# EAGLE design Main (EAGLE 4.16)
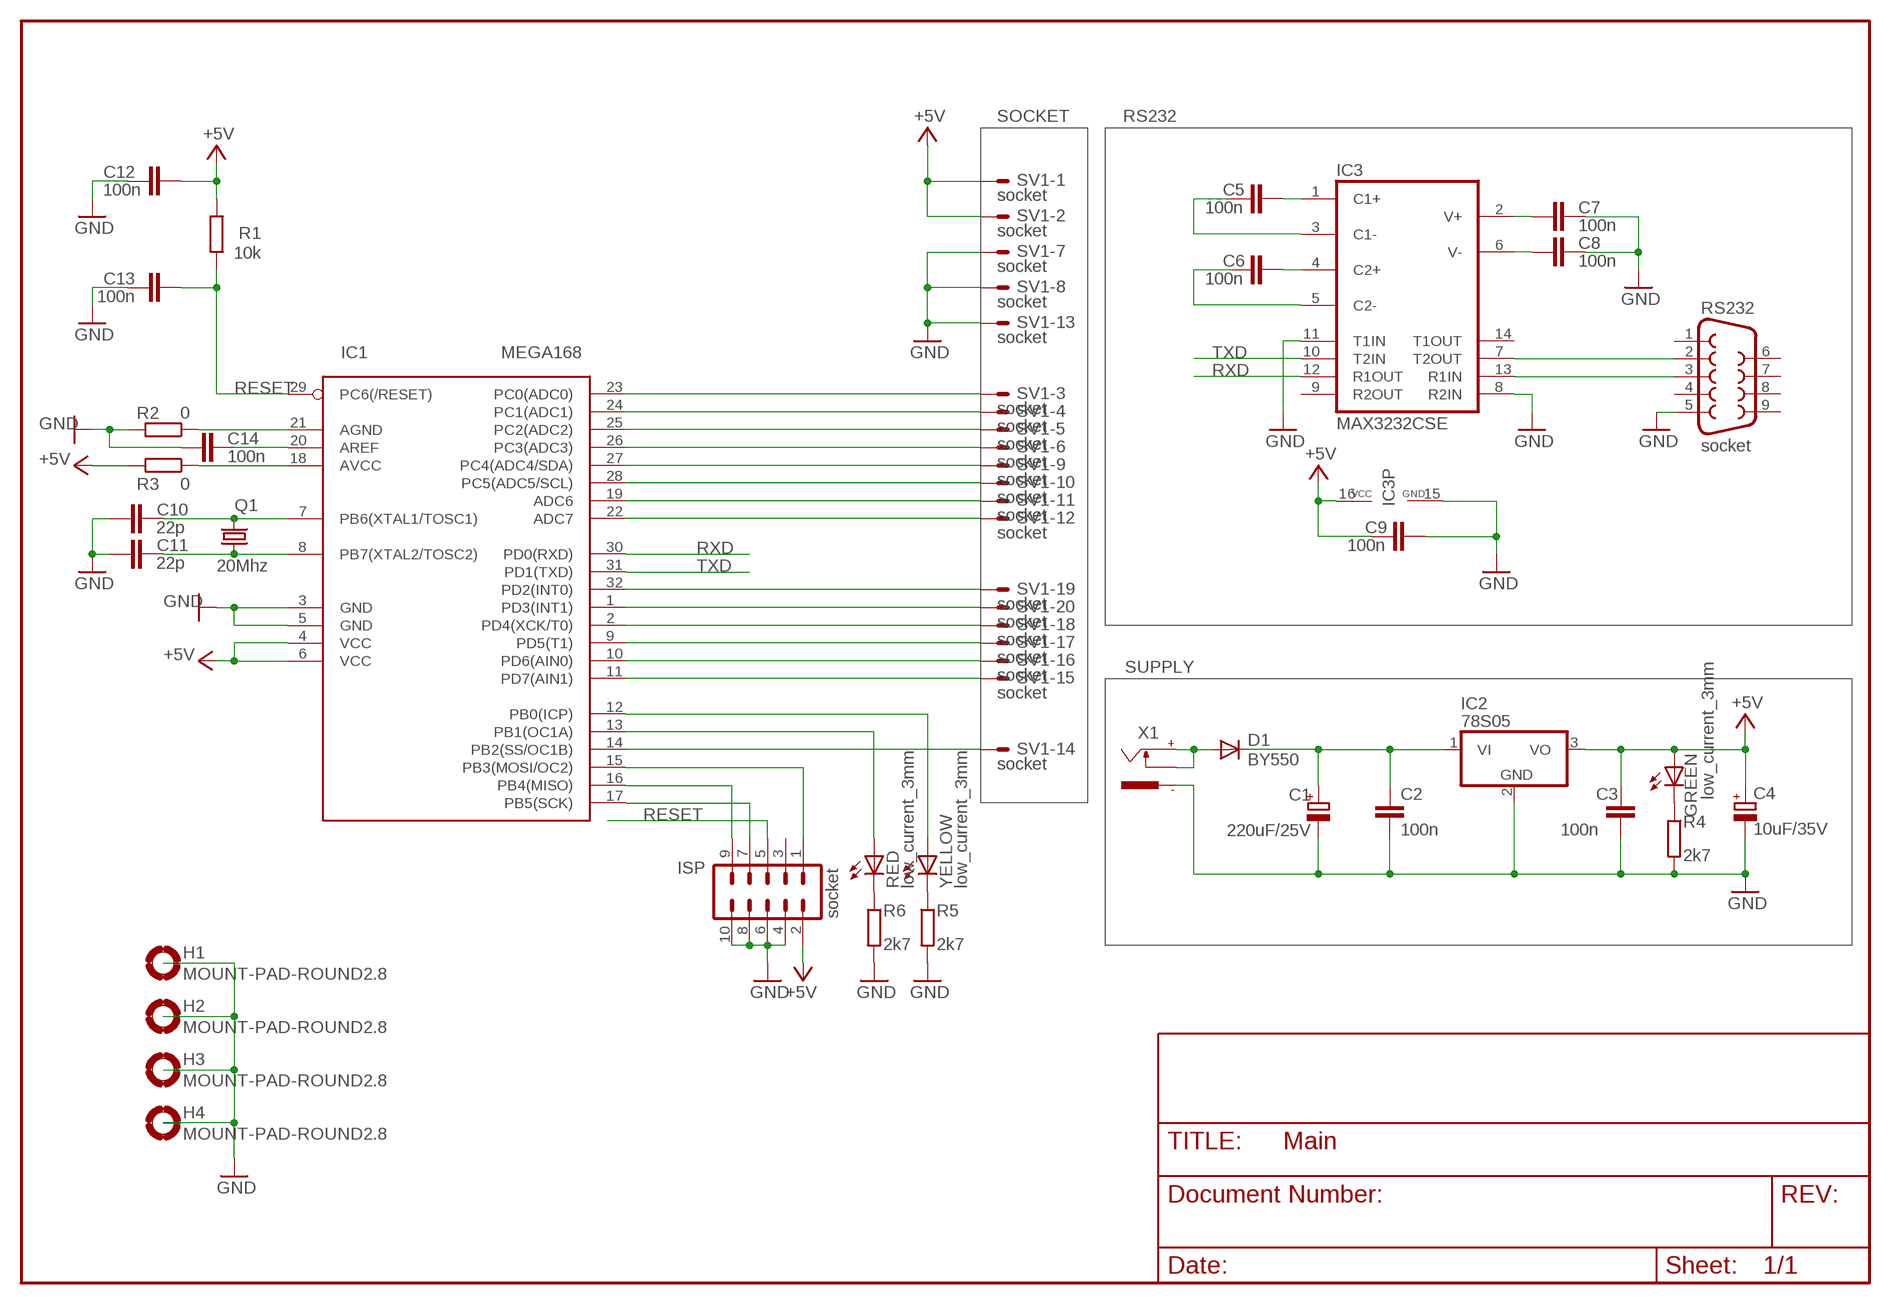
[diagram p0: schematic, sheet 1]

## Parts
C1  220uF/25V  CPOL-EUE3.5-8  [E3,5-8]
C2  100n  C-EUC0603K  [C0603K]
C3  100n  C-EUC0603K  [C0603K]
C4  10uF/35V  CPOL-EUE2-5  [E2-5]
C5  100n  C-EUC0603K  [C0603K]
C6  100n  C-EUC0603K  [C0603K]
C7  100n  C-EUC0603K  [C0603K]
C8  100n  C-EUC0603K  [C0603K]
C9  100n  C-EUC0603K  [C0603K]
C10  22p  C-EUC0603K  [C0603K]
C11  22p  C-EUC0603K  [C0603K]
C12  100n  C-EUC0603K  [C0603K]
C13  100n  C-EUC0603K  [C0603K]
C14  100n  C-EUC0603K  [C0603K]
D1  BY550  [DO27-15]
GREEN  low_current_3mm  LED3MM  [LED3MM]
H1  MOUNT-PAD-ROUND2.8  [2,8-PAD]
H2  MOUNT-PAD-ROUND2.8  [2,8-PAD]
H3  MOUNT-PAD-ROUND2.8  [2,8-PAD]
H4  MOUNT-PAD-ROUND2.8  [2,8-PAD]
IC1  MEGA168  MEGA8-AI  [TQFP32-08]
IC2  78S05  7805T  [TO220H]
IC3  MAX3232CSE  [SO16]
ISP  socket  MA05-2  [MA05-2]
Q1  20Mhz  CRYTALHC49U-V  [HC49U-V]
R1  10k  R-EU_R0805  [R0805]
R2  0  R-EU_R0805  [R0805]
R3  0  R-EU_R0805  [R0805]
R4  2k7  R-EU_R0805  [R0805]
R5  2k7  R-EU_R0805  [R0805]
R6  2k7  R-EU_R0805  [R0805]
RED  low_current_3mm  LED3MM  [LED3MM]
RS232  socket  F09HP  [F09HP]
SV1  socket  ML20E  [ML20]
X1  737992-55  [737992-5]
YELLOW  low_current_3mm  LED3MM  [LED3MM]

## Nets
+5V: C3.1 C4.+ C9.1 C12.2 GREEN.A IC1.4(VCC) IC1.6(VCC) IC2.3(VO) IC3.16(VCC) ISP.2 R1.2 R3.2 SV1.1 SV1.2
GND: C1.- C2.2 C3.2 C4.- C7.2 C8.2 C9.2 C10.1 C11.1 C12.1 C13.1 C14.1 H1.B2,8(MOUNT) H2.B2,8(MOUNT) H3.B2,8(MOUNT) H4.B2,8(MOUNT) IC1.3(GND) IC1.5(GND) IC2.2(GND) IC3.8(R2IN) IC3.11(T1IN) IC3.15(GND) ISP.4 ISP.6 ISP.8 ISP.10 R2.2 R4.2 R5.2 R6.2 RS232.5 SV1.7 SV1.8 SV1.13 X1.-1
MISO: IC1.16(PB4(MISO)) ISP.9
MOSI: IC1.15(PB3(MOSI/OC2)) ISP.1
N$1: C1.+ C2.1 D1.C IC2.1(VI)
N$2: IC3.13(R1IN) RS232.3
N$3: IC3.7(T2OUT) RS232.2
N$4: C5.2 IC3.1(C1+)
N$5: C6.2 IC3.4(C2+)
N$6: C5.1 IC3.3(C1-)
N$7: C6.1 IC3.5(C2-)
N$8: C7.1 IC3.2(V+)
N$9: C8.1 IC3.6(V-)
N$10: C10.2 IC1.7(PB6(XTAL1/TOSC1)) Q1.2
N$11: C11.2 IC1.8(PB7(XTAL2/TOSC2)) Q1.1
N$12: D1.A X1.+ X1.K
N$13: C14.2 IC1.20(AREF)
N$14: IC1.18(AVCC) R3.1
N$15: IC1.21(AGND) R2.1
N$16: IC1.23(PC0(ADC0)) SV1.3
N$17: IC1.24(PC1(ADC1)) SV1.4
N$18: IC1.25(PC2(ADC2)) SV1.5
N$19: IC1.26(PC3(ADC3)) SV1.6
N$20: IC1.27(PC4(ADC4/SDA)) SV1.9
N$21: IC1.28(PC5(ADC5/SCL)) SV1.10
N$22: IC1.19(ADC6) SV1.11
N$23: IC1.22(ADC7) SV1.12
N$24: IC1.10(PD6(AIN0)) SV1.16
N$25: IC1.11(PD7(AIN1)) SV1.15
N$26: IC1.9(PD5(T1)) SV1.17
N$27: IC1.2(PD4(XCK/T0)) SV1.18
N$28: IC1.1(PD3(INT1)) SV1.20
N$29: IC1.32(PD2(INT0)) SV1.19
N$30: IC1.14(PB2(SS/OC1B)) SV1.14
N$31: GREEN.K(C) R4.1
N$32: IC1.12(PB0(ICP)) YELLOW.A
N$33: R5.1 YELLOW.K(C)
N$34: R6.1 RED.K(C)
N$35: IC1.13(PB1(OC1A)) RED.A
RESET: C13.2 IC1.29(PC6(/RESET)) ISP.5 R1.1
RXD: IC1.30(PD0(RXD)) IC3.12(R1OUT)
SCK: IC1.17(PB5(SCK)) ISP.7
TXD: IC1.31(PD1(TXD)) IC3.10(T2IN)
Unconnected: IC3.9(R2OUT) IC3.14(T1OUT) ISP.3 RS232.1 RS232.4 RS232.6 RS232.7 RS232.8 RS232.9 X1.-2

## Notes on the sheet
- SOCKET | RS232
- SUPPLY

## Library data of the parts
C1 C4 = rcl:CPOL-EU: POLARIZED CAPACITOR, European symbol
C2 C3 C5-C14 = rcl:C-EU: CAPACITOR, European symbol
D1 = diode:BY550: DIODE Si200 V, 5 A
GREEN RED YELLOW = led:LED: LED OSRAM: - CHIPLED LG R971, LG N971, LY N971, LG Q971, LY Q971, LO R971, LY R971 LH N974, LH R974 LS Q976, LO Q976, LY Q976 LO Q996 - Hyper CHIPLED LW Q18S LB Q993, LB Q99A, LB R99A - SideLED LS A670, LO A670, LY A670, LG A670, LP A670 LB A673, LV A673, LT A673, LW A673 LH A674 LY A675 LS A676, LA A676, LO A676, LY A676, LW A676 LS A679, LY A679, LG A679 - Hyper Micro SIDELED® LS Y876, LA Y876, LO Y876, LY Y876 LT Y87S - SmartLED LW L88C, LW L88S LB L89C, LB L89S, LG L890 LS L89K, LO L89K, LY L89K LS L896, LA L896, LO L896, LY L896 - TOPLED LS T670, LO T670, LY T670, LG T670, LP T670 LSG T670, LSP T670, LSY T670, LOP T670, LYG T670 LG T671, LOG T671, LSG T671 LB T673, LV T673, LT T673, LW T673 LH T674 LS T676, LA T676, LO T676, LY T676, LB T676, LH T676, LSB T676, LW T676 LB T67C, LV T67C, LT T67C, LS T67K, LO T67K, LY T67K, LW E67C LS E67B, LA E67B, LO E67B, LY E67B, LB E67C, LV E67C, LT E67C LW T67C LS T679, LY T679, LG T679 LS T770, LO T770, LY T770, LG T770, LP T770 LB T773, LV T773, LT T773, LW T773 LH T774 LS E675, LA E675, LY E675, LS T675 LS T776, LA T776, LO T776, LY T776, LB T776 LHGB T686 LT T68C, LB T68C - Hyper Mini TOPLED® LB M676 - Mini TOPLED Santana® LG M470 LS M47K, LO M47K, LY M47K Source: http://www.osram.convergy.de - LUMILED® LXK2-PW12-R00, LXK2-PW12-S00, LXK2-PW14-U00, LXK2-PW14-V00 LXK2-PM12-R00, LXK2-PM12-S00, LXK2-PM14-U00 LXK2-PE12-Q00, LXK2-PE12-R00, LXK2-PE12-S00, LXK2-PE14-T00, LXK2-PE14-U00 LXK2-PB12-K00, LXK2-PB12-L00, LXK2-PB12-M00, LXK2-PB14-N00, LXK2-PB14-P00, LXK2-PB14-Q00 LXK2-PR12-L00, LXK2-PR12-M00, LXK2-PR14-Q00, LXK2-PR14-R00 LXK2-PD12-Q00, LXK2-PD12-R00, LXK2-PD12-S00 LXK2-PH12-R00, LXK2-PH12-S00 LXK2-PL12-P00, LXK2-PL12-Q00, LXK2-PL12-R00 Source: www.luxeon.com
H1-H4 = holes:MOUNT-PAD-ROUND: MOUNTING PAD, round
IC1 = atmel:MEGA8: MICROCONTROLLER 8 Kbytes FLASH 1 kbytes SRAM 512 bytes EEPROM USART 6-channel 10 bit ADC 2-channel 8 bit ADC Source: avr.lbr
IC2 = linear:78*: Positive VOLTAGE REGULATOR Source: http://cache.national.com/ds/LM/LM78L05.pdf http://www.fairchildsemi.com/ds/LM/LM7805.pdf
IC3 = maxim:MAX3232*: True RS-232 Transceivers 3.0V to 5.5V, Low-Power up to 1Mbps, Using Four 0.1µF External Capacitors Source: http://pdfserv.maxim-ic.com/en/ds/MAX3222-MAX3241.pdf
ISP = con-lstb:MA05-2: PIN HEADER
Q1 = crystal:CRYTAL: CRYSTAL
R1-R6 = rcl:R-EU_: RESISTOR, European symbol
RS232 = con-subd:F09: SUB-D
SV1 = con-harting-ml:ML20?E: HARTING
X1 = con-conrad:737992-55: FEMALE PRINT CONNECTOR DIN 45323 (34V/3A), ROKA, distributor Conrad

## Board
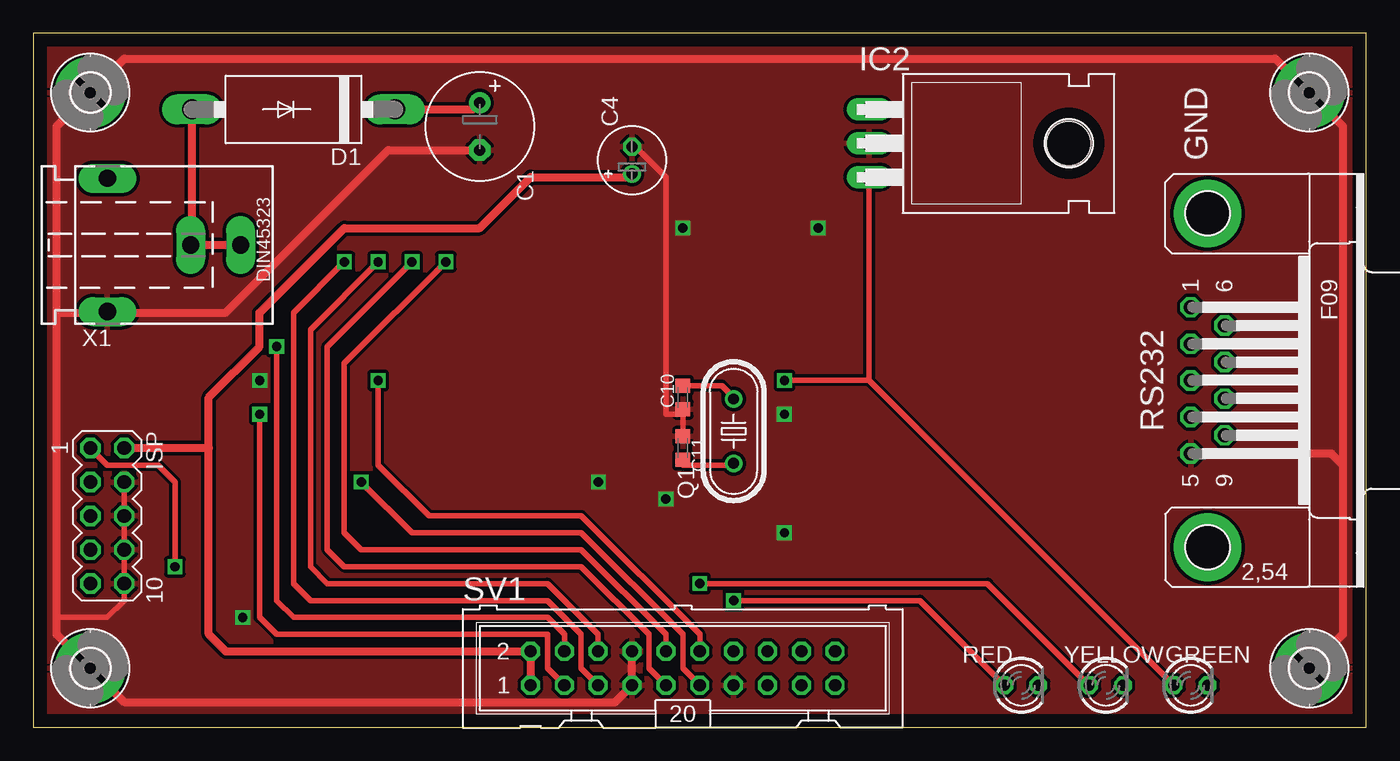
[diagram p1: board, top side]
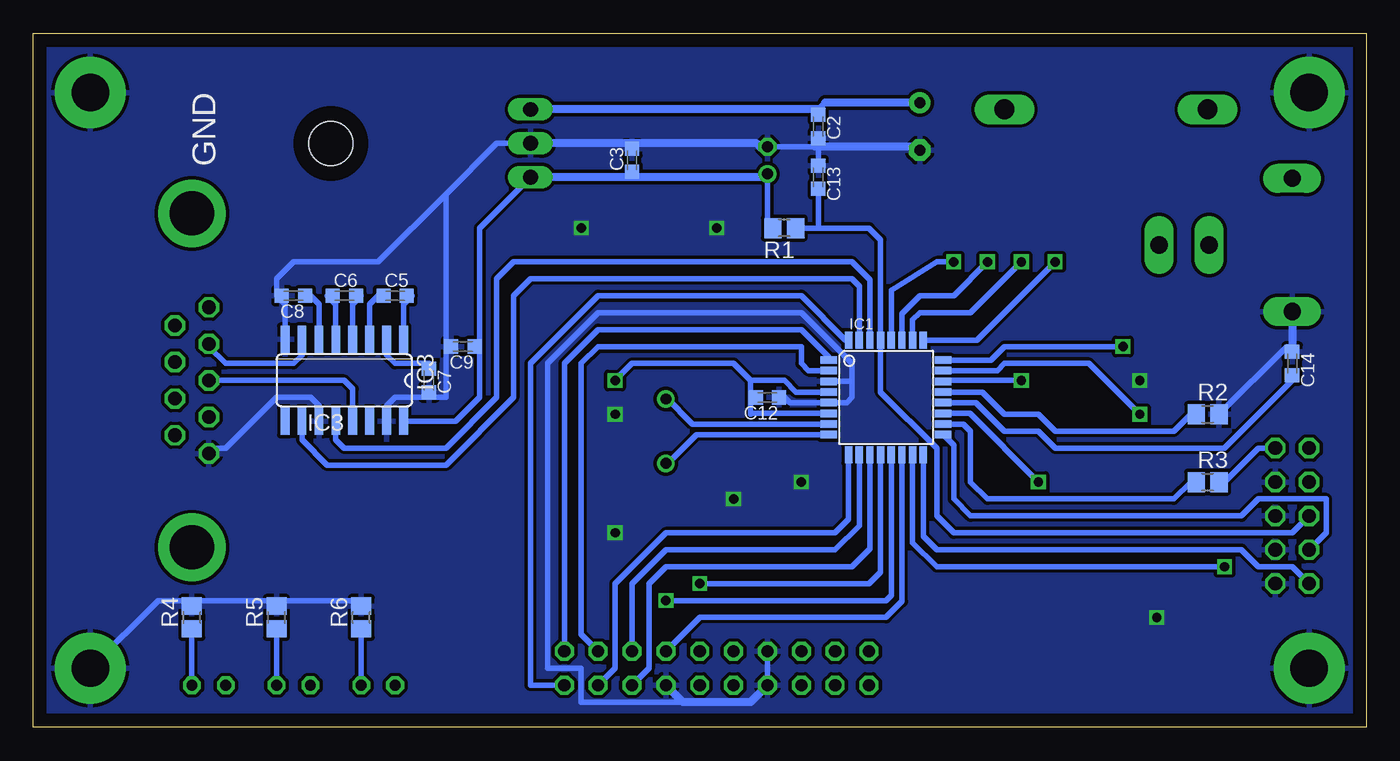
[diagram p2: board, bottom side, seen from below]

Size 100 x 52.05 mm. Coordinates in mm from the lower left corner, seen from the top.
Outline: 0,52.05 0,0 100,0 100,52.05 0,52.05
Copper layers (1*16): Top 0.035mm / dielectric 1.5mm / Bottom 0.035mm
Design rules "olimex_8mils": minimum track width 10mil, minimum drill 24mil, track to track 8mil, track to pad 8mil, pad to pad 8mil, via to via 8mil, smd to smd 8mil, copper to edge 40mil, drill to drill 10mil, minimum pad ring 10mil, minimum via ring 8mil, stop-mask expansion 0mil, vias tented up to drill 0mil, thermal gap 10mil

### Footprints (pad centres in the part's own frame; a part is rotated, then mirrored left to right if it is on the bottom)
E3,5-8 = drill 0.813 pad 1.6 round: + -1.778,0 | drill 0.813 pad 1.6 octagon: - 1.778,0
C0603K = smd 1.05 x 1.08: 1 -0.875,0; 2 0.875,0
E2-5 = drill 0.813 pad 1.27 round: + -1.016,0 | drill 0.813 pad 1.27 octagon: - 1.016,0
DO27-15 = drill 1.499 long: A 7.62,0; C -7.62,0
LED3MM = drill 0.813 octagon: A -1.27,0; K 1.27,0
2,8-PAD = drill 2.8 pad 5.334 round: B2,8 0,0
TQFP32-08 = smd 1.27 x 0.559: 1 -4.293,2.8; 2 -4.293,2; 3 -4.293,1.2; 4 -4.293,0.4; 5 -4.293,-0.4; 6 -4.293,-1.2; 7 -4.293,-2; 8 -4.293,-2.8; 17 4.293,-2.8; 18 4.293,-2; 19 4.293,-1.2; 20 4.293,-0.4; 21 4.293,0.4; 22 4.293,1.2; 23 4.293,2; 24 4.293,2.8 | smd 0.559 x 1.27: 9 -2.8,-4.293; 10 -2,-4.293; 11 -1.2,-4.293; 12 -0.4,-4.293; 13 0.4,-4.293; 14 1.2,-4.293; 15 2,-4.293; 16 2.8,-4.293; 25 2.8,4.293; 26 2,4.293; 27 1.2,4.293; 28 0.4,4.293; 29 -0.4,4.293; 30 -1.2,4.293; 31 -2,4.293; 32 -2.8,4.293
TO220H = drill 1.118 long: 1 -2.54,-10.16; 2 0,-10.16; 3 2.54,-10.16 | hole 3.302: 0,4.826
SO16 = smd 0.66 x 2.032: 1 -4.445,-3.073; 2 -3.175,-3.073; 3 -1.905,-3.073; 4 -0.635,-3.073; 5 0.635,-3.073; 6 1.905,-3.073; 7 3.175,-3.073; 8 4.445,-3.073; 9 4.445,3.073; 10 3.175,3.073; 11 1.905,3.073; 12 0.635,3.073; 13 -0.635,3.073; 14 -1.905,3.073; 15 -3.175,3.073; 16 -4.445,3.073
MA05-2 = drill 1.016 octagon: 1 -5.08,-1.27; 2 -5.08,1.27; 3 -2.54,-1.27; 4 -2.54,1.27; 5 0,-1.27; 6 0,1.27; 7 2.54,-1.27; 8 2.54,1.27; 9 5.08,-1.27; 10 5.08,1.27
HC49U-V = drill 0.813 round: 1 -2.413,0; 2 2.413,0
R0805 = smd 1.3 x 1.5: 1 -0.85,0; 2 0.85,0
F09HP = drill 1.016 octagon: 1 -5.486,-1.27; 2 -2.743,-1.27; 3 0,-1.27; 4 2.743,-1.27; 5 5.486,-1.27; 6 -4.115,1.27; 7 -1.372,1.27; 8 1.372,1.27; 9 4.115,1.27 | drill 3.302 pad 5.08 round: G1 -12.522,0; G2 12.522,0
ML20 = drill 0.914 octagon: 1 -11.43,-1.27; 2 -11.43,1.27; 3 -8.89,-1.27; 4 -8.89,1.27; 5 -6.35,-1.27; 6 -6.35,1.27; 7 -3.81,-1.27; 8 -3.81,1.27; 9 -1.27,-1.27; 10 -1.27,1.27; 11 1.27,-1.27; 12 1.27,1.27; 13 3.81,-1.27; 14 3.81,1.27; 15 6.35,-1.27; 16 6.35,1.27; 17 8.89,-1.27; 18 8.89,1.27; 19 11.43,-1.27; 20 11.43,1.27
737992-5 = drill 1.3 pad 2.184 long: + 0,10; -1 5,0; -2 -5,0; K 0,6.25

### Placement (x,y rotation side)
C1  33.49,45.07 270 top
C2  41.11,45.07 270 bottom
C3  55.08,42.53 90 bottom
C4  44.92,42.53 90 top
C5  72.86,32.37 0 bottom
C6  76.67,32.37 0 bottom
C7  70.32,26.02 270 bottom
C8  80.48,32.37 180 bottom
C9  67.78,28.56 180 bottom
C10  48.73,24.75 90 top
C11  48.73,20.94 270 top
C12  44.92,24.75 180 bottom
C13  41.11,41.26 270 bottom
C14  5.55,27.29 270 bottom
D1  19.52,46.34 180 top
GREEN  86.83,3.16 0 top
H1  4.28,4.43 0 top
H2  4.28,47.61 0 top
H3  95.72,47.61 0 top
H4  95.72,4.43 0 top
IC1  36.03,24.75 0 bottom
IC2  72.86,43.8 270 top
IC3  76.67,26.02 180 bottom
ISP  5.55,15.86 270 top
Q1  52.54,22.21 90 top
R1  43.65,37.45 180 bottom
R2  11.9,23.48 0 bottom
R3  11.9,18.4 0 bottom
R4  88.1,8.24 90 bottom
R5  81.75,8.24 90 bottom
R6  75.4,8.24 90 bottom
RED  74.13,3.16 0 top
RS232  88.1,26.02 270 top
SV1  48.73,4.43 0 top
X1  5.55,36.18 270 top
YELLOW  80.48,3.16 0 top

### Tracks (layer width: path | path; a pad name or v marks a point on that pad's centre or on a via)
+5V  (via drill 0.7)
  Top 0.406: 62.7,26.02 GREEN.A | IC2.3 62.7,26.02 | 62.7,26.02 v56.35,26.02
  Top 0.61: SV1.1 SV1.2 14.44,5.7 13.17,6.97 13.17,20.94 | 13.17,20.94 13.17,24.75 16.98,28.56 16.98,31.1 23.33,37.45 33.49,37.45 37.3,41.26 44.92,41.26 C4.+ | 13.17,20.94 ISP.2
  Bottom 0.406: IC1.4 42.78,25.15 43.65,26.02 46.19,26.02 | IC1.6 46.12,23.55 46.19,23.48 46.19,24.75 | 46.19,26.02 46.19,24.75 | 46.19,24.75 C12.2 | R1.2 44.92,37.87 44.92,41.26 | IC3.16 68.31,22.95 66.51,24.75 66.51,28.56 | 66.51,28.56 66.51,37.45 IC2.3 | 46.19,26.02 47.46,27.29 55.08,27.29 v56.35,26.02 | 66.51,28.56 C9.1 | R3.2 10.63,18.4 8.09,20.94 ISP.2
  Bottom 0.61: C4.+ 44.92,41.26 55.08,41.26 | 55.08,41.26 IC2.3 | 55.08,41.26 C3.1
GND  (via drill 0.7)
  Top 0.406: 48.73,23.48 C11.1 | C4.- 44.92,43.8 47.46,41.26 47.46,23.48 48.73,23.48 | 48.73,23.48 C10.1 | 1.74,8.24 5.55,8.24 6.82,9.51 ISP.10 ISP.8 ISP.6 ISP.4
  Top 0.61: 1.74,31.1 1.74,8.24 1.74,6.97 H1.B2,8 6.82,1.89 43.65,1.89 SV1.7 SV1.8 | 1.74,31.1 1.74,45.07 H2.B2,8 6.82,50.15 93.18,50.15 H3.B2,8 98.26,45.07 98.26,19.67 | H4.B2,8 98.26,6.97 98.26,19.67 | RS232.5 97.4,20.53 98.26,19.67 | C1.- 26.63,43.29 14.44,31.1 5.55,31.1 | 5.55,31.1 X1.-1 | 1.74,31.1 5.55,31.1
  Bottom 0.406: IC3.15 73.5,24.12 72.86,24.75 70.32,24.75 | 70.32,24.75 C7.2 | 81.75,32.37 C8.2 | IC3.8 81.12,31.73 81.75,32.37 | SV1.7 SV1.8 | 70.32,24.75 69.05,24.75 69.05,28.56 | 81.75,32.37 81.75,33.64 80.48,34.91 74.13,34.91 69.05,39.99 | IC2.2 65.24,43.8 69.05,39.99 | C12.1 43.65,24.75 43.25,24.35 IC1.5 38.97,24.35 38.57,24.75 38.57,26.02 | R2.2 5.97,28.56 5.55,28.56 C14.1 | 45.32,43.41 44.92,43.8 C4.- 41.36,43.55 41.11,43.8 | 41.11,43.8 C2.2 | 41.11,43.8 C13.1 | 69.05,39.99 69.05,28.56 | IC1.3 38.64,25.95 38.57,26.02 | 38.57,26.02 38.57,27.29 42.38,31.1 57.62,31.1 61.43,27.29 61.43,4.43 58.89,4.43 58.89,1.89 51.27,1.89 | 69.05,28.56 C9.2 | IC3.11 78.58,24.12 79.21,24.75 81.75,24.75 85.56,20.94 86.83,20.94 RS232.5 | H4.B2,8 90.64,9.51 88.1,9.51 R4.2 87.68,9.51 81.75,9.51 R5.2 81.33,9.51 75.4,9.51 R6.2
  Bottom 0.61: SV1.7 46.19,1.89 51.27,1.89 SV1.13 | C1.- 33.49,43.8 33.74,43.55 41.36,43.55 | 55.08,43.8 IC2.2 | 55.08,43.8 C3.2 | 45.32,43.41 45.71,43.8 55.08,43.8 | X1.-1 5.55,28.56
  other vias: 42.38,18.4 47.46,17.13 56.35,14.59 56.35,23.48 16.98,26.02 15.71,8.24 48.73,37.45 58.89,37.45
  pour Top (isolate 0.254): 0.47,51.42 99.53,51.42 99.53,0.62 0.47,0.62
  pour Bottom (isolate 0.254): 0.47,51.42 99.53,51.42 99.53,0.62 0.47,0.62
MISO
  Bottom 0.406: IC1.16 33.23,14.33 32.22,13.32 9.36,13.32 8.09,12.05 5.55,12.05 ISP.9
MOSI  (via drill 0.7)
  Top 0.406: v10.63,12.05 10.63,18.4 9.36,19.67 5.55,19.67 ISP.1
  Bottom 0.406: IC1.15 34.03,13.86 32.22,12.05 v10.63,12.05
N$1
  Top 0.406: C1.+ 33.49,46.34
  Top 0.61: C1.+ 32.98,46.34 D1.C
  Bottom 0.406: 40.6,46.85 41.11,46.34 C2.1
  Bottom 0.61: C1.+ 40.6,46.85 | 41.11,46.34 IC2.1
N$2
  Bottom 0.406: IC3.13 76.03,25.39 76.67,26.02 RS232.3
N$3
  Bottom 0.406: 79.84,29.2 IC3.7 79.84,27.93 80.48,27.29 85.56,27.29 86.83,28.56
  Bottom 0.61: 86.83,28.56 RS232.2
N$4
  Bottom 0.406: C5.2 71.59,32.37 72.23,31.73 IC3.1
N$5
  Bottom 0.406: C6.2 75.4,32.37 76.03,31.73 IC3.4
N$6
  Bottom 0.406: C5.1 74.13,32.37 74.77,31.73 IC3.3
N$7
  Bottom 0.406: C6.1 77.94,32.37 77.31,31.73 IC3.5
N$8
  Bottom 0.406: IC3.2 73.5,27.93 72.86,27.29 70.32,27.29 C7.1
N$9
  Bottom 0.406: C8.1 79.21,32.37 78.58,31.73 IC3.6
N$10
  Top 0.406: Q1.2 52.54,24.75 51.67,25.62 C10.2
  Bottom 0.406: Q1.2 52.54,24.75 50.54,22.75 IC1.7
N$11
  Top 0.406: Q1.1 52.54,19.67 48.73,19.67 C11.2
  Bottom 0.406: Q1.1 52.54,19.67 50.26,21.95 IC1.8
N$12
  Top 0.61: D1.A 11.9,36.28 X1.K X1.+
N$13
  Bottom 0.406: C14.2 5.55,26.02 6.82,24.75 | 6.82,24.75 7.22,24.35 | 6.82,24.75 10.63,20.94 23.33,20.94 24.6,22.21 27.14,22.21 29.28,24.35 IC1.20
N$14
  Bottom 0.406: IC1.18 30.22,22.75 29.68,22.21 29.68,18.4 28.41,17.13 14.44,17.13 13.17,18.4 R3.1
N$15
  Bottom 0.406: IC1.21 28.81,25.15 27.14,23.48 24.6,23.48 23.33,22.21 14.44,22.21 13.17,23.48 R2.1
N$16  (via drill 0.7)
  Top 0.406: SV1.3 38.57,4.43 38.57,6.97 18.25,6.97 16.98,8.24 v16.98,23.48
  Bottom 0.406: IC1.23 27.68,26.75 27.14,27.29 20.79,27.29 v16.98,23.48
N$17  (via drill 0.7)
  Top 0.406: SV1.4 39.84,6.97 38.57,8.24 19.52,8.24 18.25,9.51 v18.25,28.56
  Bottom 0.406: IC1.24 28.15,27.55 27.14,28.56 v18.25,28.56
N$18  (via drill 0.7)
  Top 0.406: SV1.5 41.11,4.43 41.11,6.97 38.57,9.51 20.79,9.51 19.52,10.78 19.52,31.1 v23.33,34.91
  Bottom 0.406: IC1.25 29.2,29.04 v23.33,34.91
N$19  (via drill 0.7)
  Top 0.406: SV1.6 42.38,6.97 38.57,10.78 22.06,10.78 20.79,12.05 20.79,29.83 v25.87,34.91
  Bottom 0.406: IC1.26 34.03,30.56 33.49,31.1 29.68,31.1 v25.87,34.91
N$20  (via drill 0.7)
  Top 0.406: SV1.9 46.19,4.43 46.19,6.97 41.11,12.05 23.33,12.05 22.06,13.32 22.06,28.56 v28.41,34.91
  Bottom 0.406: IC1.27 34.83,31.03 33.49,32.37 30.95,32.37 v28.41,34.91
N$21  (via drill 0.7)
  Top 0.406: SV1.10 47.46,6.97 41.11,13.32 24.6,13.32 23.33,14.59 23.33,27.29 v30.95,34.91
  Bottom 0.406: IC1.28 35.63,32.77 32.22,34.91 v30.95,34.91
N$22  (via drill 0.7)
  Top 0.406: SV1.11 48.73,4.43 48.73,6.97 41.11,14.59 28.41,14.59 v24.6,18.4
  Bottom 0.406: IC1.19 29.75,23.55 v24.6,18.4
N$23  (via drill 0.7)
  Top 0.406: SV1.12 50,6.97 41.11,15.86 29.68,15.86 25.87,19.67 v25.87,26.02
  Bottom 0.406: IC1.22 31.67,26.02 v25.87,26.02
N$24
  Bottom 0.406: IC1.10 38.03,15.13 39.84,13.32 52.54,13.32 55.08,10.78 SV1.16
N$25
  Bottom 0.406: IC1.11 37.23,13.39 38.57,12.05 52.54,12.05 53.81,10.78 53.81,4.43 SV1.15
N$26
  Bottom 0.406: IC1.9 38.83,15.6 39.84,14.59 52.54,14.59 56.35,10.78 56.35,4.43 SV1.17
N$27
  Bottom 0.406: IC1.2 41.84,26.75 42.38,27.29 42.38,28.56 57.62,28.56 58.89,27.29 58.89,6.97 SV1.18
N$28
  Bottom 0.406: IC1.1 40.32,27.77 42.38,29.83 57.62,29.83 60.16,27.29 SV1.20
N$29
  Bottom 0.406: IC1.32 39.05,29.04 42.38,32.37 57.62,32.37 62.7,27.29 62.7,3.16 SV1.19
N$30
  Bottom 0.406: IC1.14 34.83,9.44 36.03,8.24 50,8.24 SV1.14
N$31
  Bottom 0.406: GREEN.K R4.1
N$32  (via drill 0.7)
  Top 0.406: v50,10.78 71.59,10.78 YELLOW.A
  Bottom 0.406: IC1.12 36.43,11.65 37.3,10.78 v50,10.78
N$33
  Bottom 0.406: YELLOW.K R5.1
N$34
  Bottom 0.406: RED.K R6.1
N$35  (via drill 0.7)
  Top 0.406: RED.A 66.51,9.51 v52.54,9.51
  Bottom 0.406: v52.54,9.51 36.03,9.51 35.63,9.91 IC1.13
RESET
  Bottom 0.406: 41.11,37.45 37.3,37.45 36.43,36.58 IC1.29 36.43,25.15 32.22,20.94 32.22,15.86 30.95,14.59 5.55,14.59 ISP.5 | 41.11,37.45 R1.1 | 41.11,37.45 C13.2
RXD
  Bottom 0.406: IC1.30 37.23,33.57 38.57,34.91 63.97,34.91 65.24,33.64 65.24,24.75 69.05,20.94 76.67,20.94 77.31,21.58 IC3.12
SCK
  Bottom 0.406: IC1.17 30.95,21.16 30.95,17.13 29.68,15.86 9.36,15.86 8.09,17.13 3.01,17.13 3.01,14.59 ISP.7
TXD
  Bottom 0.406: IC1.31 38.03,33.1 38.57,33.64 62.7,33.64 63.97,32.37 63.97,24.75 69.05,19.67 77.94,19.67 79.84,21.58 IC3.10

### Text on the board
tNames: GND
bNames: GND